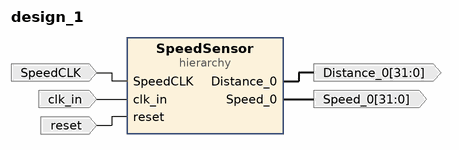
[diagram p0: block diagram of the top level]
# Vivado block design design_1, xc7z020clg400-1, Vivado 2023.2
create_bd_design design_1

create_bd_port -dir I -type clk clk_in
set_property -dict {CONFIG.FREQ_HZ 125000000} [get_bd_ports clk_in]
create_bd_port -dir I SpeedCLK
create_bd_port -dir I -type rst reset
create_bd_port -dir O -from 31 -to 0 Distance_0
create_bd_port -dir O -from 31 -to 0 Speed_0

create_bd_cell -type hier SpeedSensor

# ---- hierarchy /SpeedSensor ----
current_bd_instance /SpeedSensor
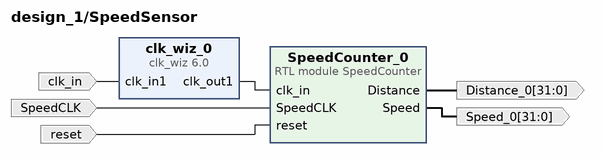
[diagram p1: block diagram inside /SpeedSensor]
create_bd_pin -dir I -type clk clk_in
create_bd_pin -dir I SpeedCLK
create_bd_pin -dir I -type rst reset
create_bd_pin -dir O -from 31 -to 0 Distance_0
create_bd_pin -dir O -from 31 -to 0 Speed_0

create_bd_cell -type ip -vlnv xilinx.com:ip:clk_wiz:6.0 clk_wiz_0
set_property -dict [list \
  CONFIG.CLKIN1_JITTER_PS 80.0 \
  CONFIG.CLKOUT1_JITTER 124.615 \
  CONFIG.CLKOUT1_PHASE_ERROR 96.948 \
  CONFIG.MMCM_CLKFBOUT_MULT_F 8.000 \
  CONFIG.MMCM_CLKIN1_PERIOD 8.000 \
  CONFIG.PRIM_IN_FREQ 125.000 \
  CONFIG.USE_LOCKED false \
  CONFIG.USE_RESET false \
] [get_bd_cells clk_wiz_0]
create_bd_cell -type module -reference SpeedCounter SpeedCounter_0

# ---- connections ----

current_bd_instance /SpeedSensor
connect_bd_net -net SpeedCLK_0_1 [get_bd_pins SpeedCLK] [get_bd_pins SpeedCounter_0/SpeedCLK]
connect_bd_net [get_bd_pins SpeedCounter_0/Distance] [get_bd_pins Distance_0]
connect_bd_net [get_bd_pins SpeedCounter_0/Speed] [get_bd_pins Speed_0]
connect_bd_net -net clk_in1_0_1 [get_bd_pins clk_in] [get_bd_pins clk_wiz_0/clk_in1]
connect_bd_net [get_bd_pins clk_wiz_0/clk_out1] [get_bd_pins SpeedCounter_0/clk_in]
connect_bd_net -net reset_0_1 [get_bd_pins reset] [get_bd_pins SpeedCounter_0/reset]

current_bd_instance /
connect_bd_net -net SpeedCLK_0_1 [get_bd_ports SpeedCLK] [get_bd_pins SpeedSensor/SpeedCLK]
connect_bd_net -net SpeedCounter_0_Distance [get_bd_pins SpeedSensor/Distance_0] [get_bd_ports Distance_0]
connect_bd_net -net SpeedCounter_0_Speed [get_bd_pins SpeedSensor/Speed_0] [get_bd_ports Speed_0]
connect_bd_net -net clk_in1_0_1 [get_bd_ports clk_in] [get_bd_pins SpeedSensor/clk_in]
connect_bd_net -net reset_0_1 [get_bd_ports reset] [get_bd_pins SpeedSensor/reset]

validate_bd_design
save_bd_design
